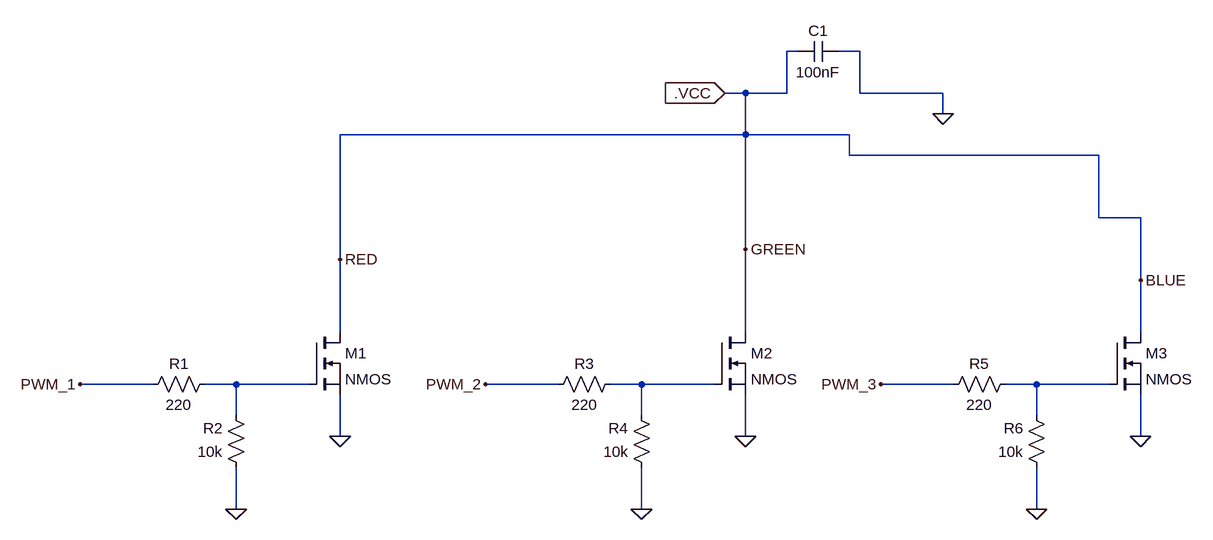
[diagram p0: schematic led.asc]
led.asc, the LTspice schematic file:
Version 4.1
SHEET 1 1796 680
WIRE 1184 -288 1168 -288
WIRE 1280 -288 1248 -288
WIRE 1104 -224 1072 -224
WIRE 1168 -224 1168 -288
WIRE 1168 -224 1104 -224
WIRE 1280 -224 1280 -288
WIRE 1408 -224 1280 -224
WIRE 1408 -192 1408 -224
WIRE 1104 -160 1104 -224
WIRE 1104 -160 480 -160
WIRE 1264 -160 1104 -160
WIRE 1264 -128 1264 -160
WIRE 1648 -128 1264 -128
WIRE 1648 -32 1648 -128
WIRE 1712 -32 1648 -32
WIRE 1104 16 1104 -160
WIRE 480 32 480 -160
WIRE 1712 64 1712 -32
WIRE 480 144 480 32
WIRE 1104 144 1104 16
WIRE 1712 144 1712 64
WIRE 192 224 80 224
WIRE 320 224 272 224
WIRE 432 224 320 224
WIRE 816 224 704 224
WIRE 944 224 896 224
WIRE 1056 224 944 224
WIRE 1424 224 1312 224
WIRE 1552 224 1504 224
WIRE 1664 224 1552 224
WIRE 320 272 320 224
WIRE 944 272 944 224
WIRE 1552 272 1552 224
WIRE 480 304 480 240
WIRE 1104 304 1104 240
WIRE 1712 304 1712 240
WIRE 320 416 320 352
WIRE 944 416 944 352
WIRE 1552 416 1552 352
FLAG 1072 -224 .VCC
IOPIN 1072 -224 In
FLAG 320 416 0
FLAG 1408 -192 0
FLAG 80 224 PWM_1
FLAG 1104 304 0
FLAG 480 304 0
FLAG 1712 304 0
FLAG 944 416 0
FLAG 704 224 PWM_2
FLAG 1552 416 0
FLAG 1312 224 PWM_3
FLAG 480 32 RED
FLAG 1104 16 GREEN
FLAG 1712 64 BLUE
SYMBOL nmos 432 144 R0
SYMATTR InstName M1
SYMBOL cap 1248 -304 R90
WINDOW 0 0 32 VBottom 2
WINDOW 3 32 32 VTop 2
SYMATTR InstName C1
SYMATTR Value 100nF
SYMBOL res 288 208 R90
WINDOW 0 0 56 VBottom 2
WINDOW 3 32 56 VTop 2
SYMATTR InstName R1
SYMATTR Value 220
SYMBOL res 336 368 R180
WINDOW 0 36 76 Left 2
WINDOW 3 36 40 Left 2
SYMATTR InstName R2
SYMATTR Value 10k
SYMBOL nmos 1056 144 R0
SYMATTR InstName M2
SYMBOL nmos 1664 144 R0
SYMATTR InstName M3
SYMBOL res 912 208 R90
WINDOW 0 0 56 VBottom 2
WINDOW 3 32 56 VTop 2
SYMATTR InstName R3
SYMATTR Value 220
SYMBOL res 960 368 R180
WINDOW 0 36 76 Left 2
WINDOW 3 36 40 Left 2
SYMATTR InstName R4
SYMATTR Value 10k
SYMBOL res 1520 208 R90
WINDOW 0 0 56 VBottom 2
WINDOW 3 32 56 VTop 2
SYMATTR InstName R5
SYMATTR Value 220
SYMBOL res 1568 368 R180
WINDOW 0 36 76 Left 2
WINDOW 3 36 40 Left 2
SYMATTR InstName R6
SYMATTR Value 10k

The netlist it stands for:
* led.asc
M1 BLUE N001 0 0 NMOS
C1 0 BLUE 100nF
R1 N001 PWM_1 220
R2 0 N001 10k
M2 BLUE N002 0 0 NMOS
M3 BLUE N003 0 0 NMOS
R3 N002 PWM_2 220
R4 0 N002 10k
R5 N003 PWM_3 220
R6 0 N003 10k
.model NMOS NMOS
.model PMOS PMOS
.lib standard.mos
.backanno
.end